# Altium project Custom Phone.PrjPcb (part 4 of 4)

## Sheet Sensors.SchDoc
size B; SheetNumber: 8; SheetTotal: 8
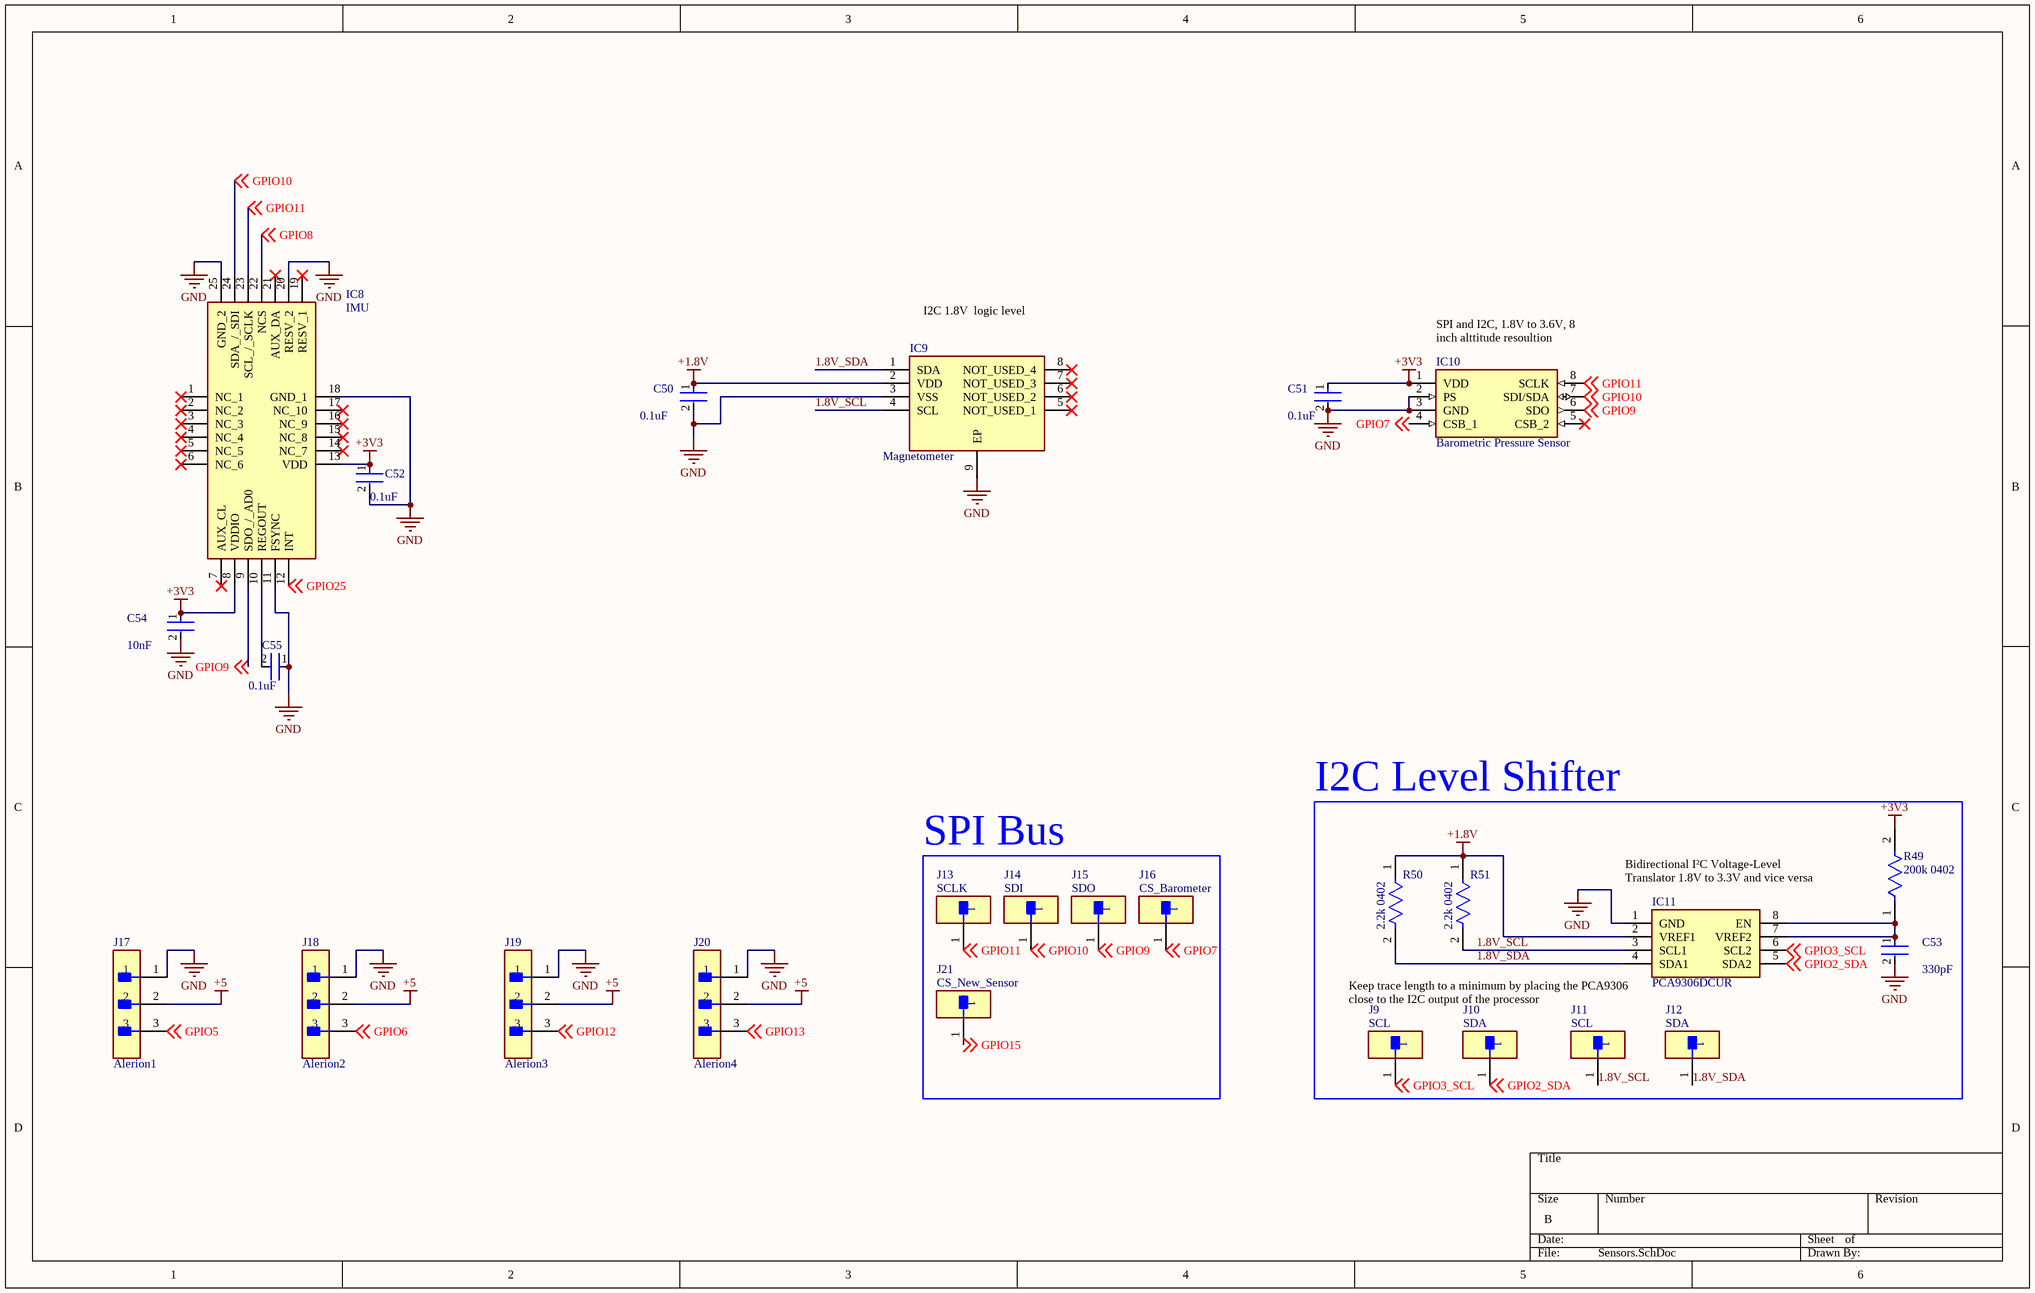
[diagram p11: Sensors.SchDoc]

### Parts
C50  0.1uF  [FP-C0402-BB-MFG]
C51  0.1uF  [FP-C0402-BB-MFG]
C52  0.1uF  [FP-C0402-BB-MFG]
C53  330pF  [FP-C0402-BB-MFG]
C54  10nF  [FP-C0402-BB-MFG]
C55  0.1uF  [FP-C0402-BB-MFG]
IC8  IMU  [QFN40P300X300X95-25N-D]
IC9  Magnetometer  [SON40P250X200X40-9N-D]
IC10  Barometric Pressure Sensor  [MS5607-02BA03]
IC11  PCA9306DCUR  [SOP50P310X90-8N]
J9  SCL  [FP-5015-MFG]
J10  SDA  [FP-5015-MFG]
J11  SCL  [FP-5015-MFG]
J12  SDA  [FP-5015-MFG]
J13  SCLK  [FP-5015-MFG]
J14  SDI  [FP-5015-MFG]
J15  SDO  [FP-5015-MFG]
J16  CS_Barometer  [FP-5015-MFG]
J17  Alerion1  [FP-TSW-103-14-G-S-MFG]
J18  Alerion2  [FP-TSW-103-14-G-S-MFG]
J19  Alerion3  [FP-TSW-103-14-G-S-MFG]
J20  Alerion4  [FP-TSW-103-14-G-S-MFG]
J21  CS_New_Sensor  [FP-5015-MFG]
R49  200k 0402  [FP-RMCF0402-MFG]
R50  2.2k 0402  [FP-RMCF0402-MFG]
R51  2.2k 0402  [FP-RMCF0402-MFG]

### Blocks framed on the sheet
I2C Level Shifter: C53 IC11 J9-J12 R49-R51
SPI Bus: J13-J16 J21

### Nets
+1.8V: C50.1 IC9.2(VDD) IC11.2(VREF1) R50.1 R51.1
+3V3: C51.1 C52.1 C54.1 IC8.8(VDDIO) IC8.13(VDD) IC10.1(VDD) R49.2
+5: J17.2 J18.2 J19.2 J20.2
GND: C50.2 C51.2 C52.2 C53.2 C54.2 C55.1 IC8.11(FSYNC) IC8.18(GND_1) IC8.20(RESV_2) IC8.25(GND_2) IC9.3(VSS) IC9.9(EP) IC10.2(PS) IC10.3(GND) IC11.1(GND) J17.1 J18.1 J19.1 J20.1
1.8V_SCL: IC9.4(SCL) IC11.3(SCL1) J11.1 R51.2
1.8V_SDA: IC9.1(SDA) IC11.4(SDA1) J12.1 R50.2
GPIO2_SDA: IC11.5(SDA2) J10.1 ; off-sheet GPIO2_SDA
GPIO3_SCL: IC11.6(SCL2) J9.1 ; off-sheet GPIO3_SCL
GPIO5: J17.3 ; off-sheet GPIO5
GPIO6: J18.3 ; off-sheet GPIO6
GPIO7: IC10.4(CSB_1) J16.1 ; off-sheet GPIO7
GPIO8: IC8.22(NCS) ; off-sheet GPIO8
GPIO9: IC8.9(SDO_/_AD0) IC10.6(SDO) J15.1 ; off-sheet GPIO9
GPIO10: IC8.24(SDA_/_SDI) IC10.7(SDI/SDA) J14.1 ; off-sheet GPIO10
GPIO11: IC8.23(SCL_/_SCLK) IC10.8(SCLK) J13.1 ; off-sheet GPIO11
GPIO12: J19.3 ; off-sheet GPIO12
GPIO13: J20.3 ; off-sheet GPIO13
GPIO15: J21.1 ; off-sheet GPIO15
GPIO25: IC8.12(INT) ; off-sheet GPIO25
NetC53_1: C53.1 IC11.7(VREF2) IC11.8(EN) R49.1
NetC55_2: C55.2 IC8.10(REGOUT)

Not connected (* = marked no-connect by the designer): IC8 1(NC_1)* 2(NC_2)* 3(NC_3)* 4(NC_4)* 5(NC_5)* 6(NC_6)* 7(AUX_CL)* 14(NC_7)* 15(NC_8)* 16(NC_9)* 17(NC_10)* 19(RESV_1)* 21(AUX_DA)*; IC9 5(NOT_USED_1)* 6(NOT_USED_2)* 7(NOT_USED_3)* 8(NOT_USED_4)*; IC10 5(CSB_2)*

### Notes on the sheet
- (near IC9) I2C 1.8V  logic level
- (near IC10) SPI and I2C, 1.8V to 3.6V, 8 inch alttitude resoultion
- (near IC11) Bidirectional I²C Voltage-Level Translator 1.8V to 3.3V and vice versa
- (near IC11) Keep trace length to a minimum by placing the PCA9306 close to the I2C output of the processor

### Library data of the parts
C50-C52 C55 = CMP-03020-014070-2: C307331; Manufacturer: Kemet; Manufacturer Part Number: C0402C104M3PAC7867; Material: Ceramic; Tolerance: 0.2; Temperature Characteristic: X5R; Value: 0.10 μF; Temperature Coefficient: 15%; Voltage Rating: 25 V; Height: 0.55mm; Category: Cap; Temperature: -55°C to +125°C; Automotive: No; Package: C0402-BB; Temperature Range Low: -55°C; ComponentLink2Description: Datasheet; Device Class L3: Ceramic Capacitors; ComponentLink2URL: https://content.kemet.com/datasheets/KEM_C1002_X7R_SMD.pdf; Octopart: https://octopart.com/c0402c104m3pac7867-kemet-84304880; RoHS: TRUE; Temperature Range High: +125°C; Device Class L1: Passive Components; Capacitance: 0.10 μF; Lead Free: Yes; Ipc Land Pattern Name: CAPC10050X50; Device Class L2: Capacitors; Digikey Description: CAP CER 0.1UF 25V X5R 0402
C53 = CMP-03020-014070-2: C13533; Manufacturer: Kemet; Manufacturer Part Number: C0402C104M3PAC7867; Material: Ceramic; Tolerance: 0.2; Temperature Characteristic: X5R; Value: 0.10 μF; Temperature Coefficient: 15%; Voltage Rating: 25 V; Height: 0.55mm; Category: Cap; Temperature: -55°C to +125°C; Automotive: No; Package: C0402-BB; Temperature Range Low: -55°C; ComponentLink2Description: Datasheet; Device Class L3: Ceramic Capacitors; ComponentLink2URL: https://content.kemet.com/datasheets/KEM_C1002_X7R_SMD.pdf; Octopart: https://octopart.com/c0402c104m3pac7867-kemet-84304880; RoHS: TRUE; Temperature Range High: +125°C; Device Class L1: Passive Components; Capacitance: 0.10 μF; Lead Free: Yes; Ipc Land Pattern Name: CAPC10050X50; Device Class L2: Capacitors; Digikey Description: CAP CER 0.1UF 25V X5R 0402
C54 = CMP-03020-014070-2: C15195; Manufacturer: Kemet; Manufacturer Part Number: C0402C104M3PAC7867; Material: Ceramic; Tolerance: 0.2; Temperature Characteristic: X5R; Value: 0.10 μF; Temperature Coefficient: 15%; Voltage Rating: 25 V; Height: 0.55mm; Category: Cap; Temperature: -55°C to +125°C; Automotive: No; Package: C0402-BB; Temperature Range Low: -55°C; ComponentLink2Description: Datasheet; Device Class L3: Ceramic Capacitors; ComponentLink2URL: https://content.kemet.com/datasheets/KEM_C1002_X7R_SMD.pdf; Octopart: https://octopart.com/c0402c104m3pac7867-kemet-84304880; RoHS: TRUE; Temperature Range High: +125°C; Device Class L1: Passive Components; Capacitance: 0.10 μF; Lead Free: Yes; Ipc Land Pattern Name: CAPC10050X50; Device Class L2: Capacitors; Digikey Description: CAP CER 0.1UF 25V X5R 0402
IC8 = MPU-6500: C50278; Manufacturer_Name: TDK; Datasheet Link: https://product.tdk.com/system/files/dam/doc/product/sensor/mortion-inertial/imu/data_sheet/mpu-6500-datasheet2.pdf; Height: 0.95mm; Manufacturer_Part_Number: MPU-6500; Mouser Part Number: 410-MPU-6500; Mouser Price/Stock: https://www.mouser.co.uk/ProductDetail/TDK-InvenSense/MPU-6500?qs=u4fy%2FsgLU9PiIOIlWOSPhQ%3D%3D; Arrow Part Number: MPU-6500; Arrow Price/Stock: https://www.arrow.com/en/products/mpu-6500/invensense?utm_currency=USD&region=europe
IC9 = MLX90392ELQ-AAA-011-RE: C17495733 / Digikey Replacment Part Just in Case: MLX90392ELQ-AAA-010-RE (10X finer resolution); Manufacturer_Name: Melexis; Datasheet Link: https://media.melexis.com/-/media/files/documents/datasheets/mlx90392-datasheet-melexis.pdf; Height: 0.4mm; Manufacturer_Part_Number: MLX90392ELQ-AAA-011-RE; Mouser Part Number: 482-90392ELQAAA011RE; Mouser Price/Stock: https://www.mouser.co.uk/ProductDetail/Melexis/MLX90392ELQ-AAA-011-RE?qs=DRkmTr78QAR2mFb3EZGuDA%3D%3D; LCSC: C17495733
IC10 = MS560702BA03-50: C97627; Manufacturer_Name: TE Connectivity; Datasheet Link: https://www.te.com/commerce/DocumentDelivery/DDEController?Action=srchrtrv&DocNm=MS5607-02BA03&DocType=Data%20Sheet&DocLang=English&PartCntxt=MS560702BA03-50&DocFormat=pdf; Manufacturer_Part_Number: MS560702BA03-50; Mouser Part Number: 824-MS560702BA03-50; Mouser Price/Stock: https://www.mouser.co.uk/ProductDetail/Measurement-Specialties/MS560702BA03-50?qs=urSpXqmdEVImCZG1H%252BT8ng%3D%3D; Arrow Part Number: MS560702BA03-50; Arrow Price/Stock: https://www.arrow.com/en/products/ms560702ba03-50/te-connectivity?utm_currency=USD&region=europe
IC11 = PCA9306DCUR: C33196; Manufacturer_Name: Texas Instruments; Datasheet Link: http://www.ti.com/lit/gpn/pca9306; Height: 0.9mm; Manufacturer_Part_Number: PCA9306DCUR; Mouser Part Number: 595-PCA9306DCUR; Mouser Price/Stock: https://www.mouser.co.uk/ProductDetail/Texas-Instruments/PCA9306DCUR?qs=wgAEGBTxy7nQr5PRxNBUNA%3D%3D; Arrow Part Number: PCA9306DCUR; Arrow Price/Stock: https://www.arrow.com/en/products/pca9306dcur/texas-instruments?region=nac
J9-J16 J21 = CMP-2000-05183-2: as J38-J44 on sheet Cellular; Category: Conn; Digikey Description: PC TEST POINT MINIATURE; Automotive: No; Lead Free: Yes; Octopart: https://octopart.com/5015-keystone-3822; ComponentLink2URL: http://www.keyelco.com/product-pdf.cfm?p=1353; Package: 5015; RoHS: TRUE; Device Class L3: unset; Device Class L2: unset; Contact Material: Silver; Device Class L1: Connectors; Height: 1.65mm; ComponentLink2Description: Datasheet
J17-J20 = CMP-02766-001743-1: CONN HEADER VERT 3POS 2.54MM; Max Voltage Rating (AC): 550V; Number of Positions: 3; Max Current Rating: 7.6A; Gender: Male; Termination: Solder; RoHS Compliant: Yes; Mount: Through Hole; Lead Free: Lead Free; Connector Type: Header; REACH SVHC: No SVHC; Insulation Color: Black; Width: 2.54mm; Length: 7.62mm; Flammability Rating: UL94 V-0; Housing Material: Polyester; Contact Material: Bronze; Max Operating Temperature: 125°C; Fastening Type: Pull; Series: TSW; Number of Contacts: 3; Packaging: Bulk; Min Operating Temperature: -55°C; Package Quantity: 1; Height: 10.67mm; Pitch: 2.54mm; Contact Finish - Mating: GOLD; Contact Type: Male Pin; Radiation Hardening: No; Color: Black; Housing Color: Black; Contact Plating: Gold; Orientation: Straight; Number of Rows: 1; Depth: 2.54mm; Insulation Material: PBT; Contact Mating Length: 0.32inch; Contact Shape: Square
R49 = CMP-26527-002093-1: C25764; Max Power Dissipation: 63mW; Tolerance: 5%; Resistance: 3.9R; Temperature Coefficient: 200ppm/°C; Case/Package: 0402; Number of Terminations: 2; Min Operating Temperature: -55°C; Height: 0.016inch; Packaging: Tape and Reel; Resistor Type: Thick Film; Length: 0.039inch; Mount: Surface Mount; Series: RMCF; Max Operating Temperature: 155°C; Contact Plating: Tin; Features: Automotive AEC-Q200; Width: 0.02inch; Radiation Hardening: No; RoHS Compliant: Yes
R50 R51 = CMP-26527-002093-1: C25879; Max Power Dissipation: 63mW; Tolerance: 5%; Resistance: 3.9R; Temperature Coefficient: 200ppm/°C; Case/Package: 0402; Number of Terminations: 2; Min Operating Temperature: -55°C; Height: 0.016inch; Packaging: Tape and Reel; Resistor Type: Thick Film; Length: 0.039inch; Mount: Surface Mount; Series: RMCF; Max Operating Temperature: 155°C; Contact Plating: Tin; Features: Automotive AEC-Q200; Width: 0.02inch; Radiation Hardening: No; RoHS Compliant: Yes

## Sheet Camera + Display.SchDoc
size A; SheetNumber: 9; SheetTotal: 9
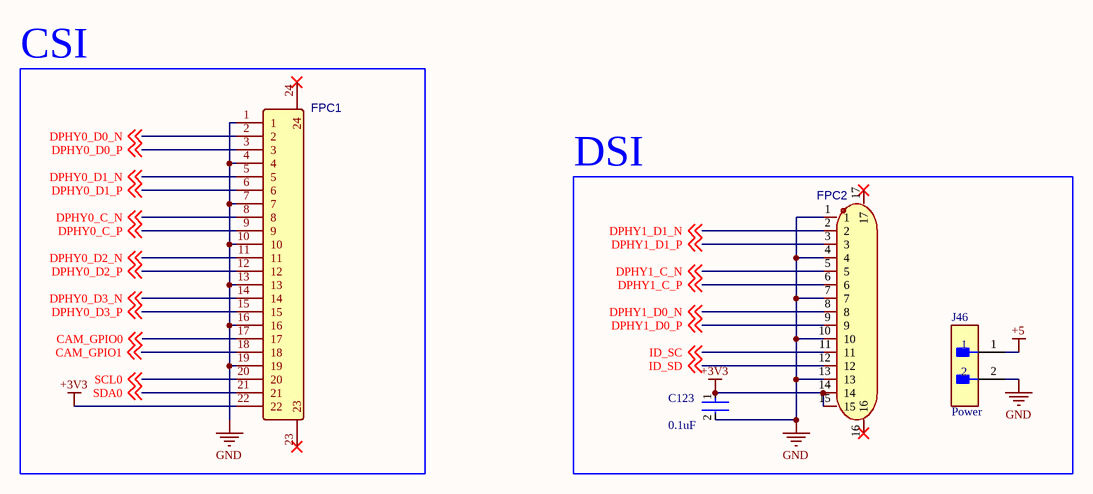
[diagram p12: Camera + Display.SchDoc]

### Parts
C123  0.1uF  [FP-C0402-BB-MFG]
FPC1  AFC01-S22FCA-00  [FPC-SMD_P0.5-22P_FGS-XJ-H2.0]  (value not drawn)
FPC2  HC-FPC-1.0-15P-FHH20  [FPC-SMD_15P-P0.50_HC-FPC-1.0-15P-FHH20]  (value not drawn)
J46  Power  [FP-TSW-102-14-G-S-MFG]

### Blocks framed on the sheet
CSI: FPC1
DSI: C123 FPC2 J46

### Nets
+3V3: C123.1 FPC1.22 FPC2.14 FPC2.15
+5: J46.1
GND: C123.2 FPC1.1 FPC1.4 FPC1.7 FPC1.10 FPC1.13 FPC1.16 FPC1.19 FPC2.1 FPC2.4 FPC2.7 FPC2.10 FPC2.13 J46.2
CAM_GPIO0: FPC1.17 ; off-sheet CAM_GPIO0
CAM_GPIO1: FPC1.18 ; off-sheet CAM_GPIO1
DPHY0_C_N: FPC1.8 ; off-sheet DPHY0_C_N
DPHY0_C_P: FPC1.9 ; off-sheet DPHY0_C_P
DPHY0_D0_N: FPC1.2 ; off-sheet DPHY0_D0_N
DPHY0_D0_P: FPC1.3 ; off-sheet DPHY0_D0_P
DPHY0_D1_N: FPC1.5 ; off-sheet DPHY0_D1_N
DPHY0_D1_P: FPC1.6 ; off-sheet DPHY0_D1_P
DPHY0_D2_N: FPC1.11 ; off-sheet DPHY0_D2_N
DPHY0_D2_P: FPC1.12 ; off-sheet DPHY0_D2_P
DPHY0_D3_N: FPC1.14 ; off-sheet DPHY0_D3_N
DPHY0_D3_P: FPC1.15 ; off-sheet DPHY0_D3_P
DPHY1_C_N: FPC2.5 ; off-sheet DPHY1_C_N
DPHY1_C_P: FPC2.6 ; off-sheet DPHY1_C_P
DPHY1_D0_N: FPC2.8 ; off-sheet DPHY1_D0_N
DPHY1_D0_P: FPC2.9 ; off-sheet DPHY1_D0_P
DPHY1_D1_N: FPC2.2 ; off-sheet DPHY1_D1_N
DPHY1_D1_P: FPC2.3 ; off-sheet DPHY1_D1_P
ID_SC: FPC2.11 ; off-sheet ID_SC
ID_SD: FPC2.12 ; off-sheet ID_SD
SCL0: FPC1.20 ; off-sheet SCL0
SDA0: FPC1.21 ; off-sheet SDA0

Not connected (* = marked no-connect by the designer): FPC1 23* 24*; FPC2 16* 17*

### Library data of the parts
C123 = CMP-03020-014070-2: as C50 on sheet Sensors; Height: 0.55mm; Category: Cap; Temperature: -55°C to +125°C; Automotive: No; Package: C0402-BB; Temperature Range Low: -55°C; ComponentLink2Description: Datasheet; Device Class L3: Ceramic Capacitors; ComponentLink2URL: https://content.kemet.com/datasheets/KEM_C1002_X7R_SMD.pdf; Octopart: https://octopart.com/c0402c104m3pac7867-kemet-84304880; RoHS: TRUE; Temperature Range High: +125°C; Device Class L1: Passive Components; Capacitance: 0.10 μF; Lead Free: Yes; Ipc Land Pattern Name: CAPC10050X50; Device Class L2: Capacitors; Digikey Description: CAP CER 0.1UF 25V X5R 0402
FPC1 = CSI Bottom Contact Right Angle: C262668; Manufacturer: JS(钜硕电子); Contributor: LCSC; Supplier: LCSC; Supplier Part: C262668; Manufacturer Part: AFC01-S22FCA-00; JLCPCB Part Class: Extended Part; spicePre: F; spiceSymbolName: AFC01-S22FCA-00
FPC2 = DSI Top and Bottom Connector: C49166884; Manufacturer: HC(虹成电子); Add into BOM: yes; Locking Feature: Hinged Lid; Number of Contacts: 15P; Pitch: 1mm; FFC, FCB Thickness: 0.3mm; Symbol: HC-FPC-1.0-15P-FHH20; Device: HC-FPC-1.0-15P-FHH20; LCSC Part Name: 翻盖式 双侧触点/上下接 P数:15P 间距:1mm; Supplier Part: C49166884; Manufacturer Part: HC-FPC-1.0-15P-FHH20; Supplier Footprint: SMD,P=1mm,卧贴; JLCPCB Part Class: Extended Part; Datasheet: https://item.szlcsc.com/datasheet/HC-FPC-1.0-15P-FHH20/51557854.html; Supplier: LCSC; Convert to PCB: yes; Contact Type: Double-Sided Contacts, Top and Bottom Entry; Mounting Type: Surface Mount, Right Angle; Height Above Board: 2mm; Contact Material: -; Contact Plating: -; Operating Temperature: -40℃~+85℃
J46 = CMP-02766-001740-1: CONN HEADER VERT 2POS 2.54MM; Number of Positions: 2; Max Current Rating: 7.6A; Gender: Male; Max Voltage Rating (AC): 550V; Contact Mating Length: 0.32inch; REACH SVHC: No SVHC; Width: 2.54mm; Insulation Material: PBT; Contact Shape: Square; Contact Plating: Gold; Min Operating Temperature: -55°C; Contact Material: Bronze; Color: Black; Number of Contacts: 2; Housing Material: Polyester; Orientation: Straight; Flammability Rating: UL94 V-0; Max Operating Temperature: 125°C; Contact Type: Male Pin; Radiation Hardening: No; Termination: Solder; RoHS Compliant: Yes; Lead Free: Lead Free; Fastening Type: Pull; Pitch: 2.54mm; Number of Rows: 1; Series: TSW; Insulation Color: Black; Package Quantity: 1; Connector Type: Header; Length: 5.08mm; Contact Finish - Mating: GOLD; Mount: Through Hole; Housing Color: Black; Depth: 2.54mm; Packaging: Bulk

## Nets that join several sheets
3V3_M2: High-Speed Interfaces (14 pins), Power (C42.2 C43.2 L3.2 R45.1)
5V_Direct_PD_Out: Power (6 pins), USBC (5 pins)
+1.8V: CM5 + IO (J1.88 J1.90), Cellular (C118.1 U4.2 U4.10), Sensors (5 pins)
+3.9V: CM5 + IO (J5.1 LED1.2), Power (C32.2 C33.2 L2.2 R38.1), Cellular (10 pins)
+3V3: CM5 + IO (21 pins), High-Speed Interfaces (J25.15 J25.17), USBC (24 pins), Cellular (5 pins), Audio (12 pins), Sensors (7 pins), Camera + Display (C123.1 FPC1.22 FPC2.14 FPC2.15)
+5: CM5 + IO (8 pins), High-Speed Interfaces (J24.19), Power (16 pins), USBC (5 pins), Audio (R101.2 R103.1), Sensors (J17.2 J18.2 J19.2 J20.2), Camera + Display (J46.1)
Bat+: Power (D5.2), Battery Management and Charging (9 pins)
GND: CM5 + IO (79 pins), High-Speed Interfaces (29 pins), Power (57 pins), Battery Management and Charging (15 pins), USBC (87 pins), Cellular (46 pins), Audio (23 pins), Sensors (19 pins), Camera + Display (14 pins)
VCC_USB_Bat: CM5 + IO (LED3.1), USBC (16 pins)
VCC_USB_Bat_Sink: Power (C10.2 IC4.2 IC4.3 Q6.2), Battery Management and Charging (C68.2 IC13.1), USBC (C89.2 Q15.3)
VCC_USB_Power: CM5 + IO (LED4.1), USBC (18 pins)
CAM_GPIO0: CM5 + IO (J1.97), Camera + Display (FPC1.17)
CAM_GPIO1: CM5 + IO (J1.100), Camera + Display (FPC1.18)
DPHY0_C_N: CM5 + IO (J2.27), Camera + Display (FPC1.8)
DPHY0_C_P: CM5 + IO (J2.29), Camera + Display (FPC1.9)
DPHY0_D0_N: CM5 + IO (J2.15), Camera + Display (FPC1.2)
DPHY0_D0_P: CM5 + IO (J2.17), Camera + Display (FPC1.3)
DPHY0_D1_N: CM5 + IO (J2.21), Camera + Display (FPC1.5)
DPHY0_D1_P: CM5 + IO (J2.23), Camera + Display (FPC1.6)
DPHY0_D2_N: CM5 + IO (J2.33), Camera + Display (FPC1.11)
DPHY0_D2_P: CM5 + IO (J2.35), Camera + Display (FPC1.12)
DPHY0_D3_N: CM5 + IO (J2.39), Camera + Display (FPC1.14)
DPHY0_D3_P: CM5 + IO (J2.41), Camera + Display (FPC1.15)
DPHY1_C_N: CM5 + IO (J2.87), Camera + Display (FPC2.5)
DPHY1_C_P: CM5 + IO (J2.89), Camera + Display (FPC2.6)
DPHY1_D0_N: CM5 + IO (J2.75), Camera + Display (FPC2.8)
DPHY1_D0_P: CM5 + IO (J2.77), Camera + Display (FPC2.9)
DPHY1_D1_N: CM5 + IO (J2.81), Camera + Display (FPC2.2)
DPHY1_D1_P: CM5 + IO (J2.83), Camera + Display (FPC2.3)
E_LED_G: CM5 + IO (J1.17), High-Speed Interfaces (R53.1)
E_LED_Y: CM5 + IO (J1.15), High-Speed Interfaces (R54.2)
GPIO2_SDA: CM5 + IO (CAM1.1 J1.58), USBC (IC16.8 U2.8), Audio (U5.18), Sensors (IC11.5 J10.1)
GPIO3_SCL: CM5 + IO (CAM1.4 J1.56), USBC (IC16.7 U2.9), Audio (U5.19), Sensors (IC11.6 J9.1)
GPIO4: CM5 + IO (J1.54), Audio (U5.20)
GPIO5: CM5 + IO (J1.34 R3.1), Sensors (J17.3)
GPIO6: CM5 + IO (J1.30 R4.1), Sensors (J18.3)
GPIO7: CM5 + IO (J1.37), Sensors (IC10.4 J16.1)
GPIO8: CM5 + IO (J1.39), Sensors (IC8.22)
GPIO9: CM5 + IO (J1.40), Sensors (IC8.9 IC10.6 J15.1)
GPIO10: CM5 + IO (J1.44), Sensors (IC8.24 IC10.7 J14.1)
GPIO11: CM5 + IO (J1.38), Sensors (IC8.23 IC10.8 J13.1)
GPIO12: CM5 + IO (J1.31 R7.1), Sensors (J19.3)
GPIO13: CM5 + IO (J1.28 R8.1), Sensors (J20.3)
GPIO15: CM5 + IO (J1.51 J7.1 W1.1 W2.1), Sensors (J21.1)
GPIO16: CM5 + IO (J1.29), Audio (R105.1 R106.2)
GPIO17: CM5 + IO (J1.50), Cellular (J37.6)
GPIO18: CM5 + IO (J1.49), Audio (IC17.16 U5.6)
GPIO19: CM5 + IO (J1.26), Audio (IC17.14 U5.7)
GPIO20: CM5 + IO (J1.27), Audio (U5.3)
GPIO21: CM5 + IO (J1.25), Audio (IC17.1)
GPIO22: CM5 + IO (J1.46), Cellular (J37.8)
GPIO23: CM5 + IO (J1.47), Cellular (J37.23 R95.1)
GPIO24: CM5 + IO (J1.45), Cellular (R97.1)
GPIO25: CM5 + IO (J1.41), Sensors (IC8.12)
HDMI0_CEC: CM5 + IO (J2.51), High-Speed Interfaces (J24.15)
HDMI0_CK_N: CM5 + IO (J2.90), High-Speed Interfaces (J24.14)
HDMI0_CK_P: CM5 + IO (J2.88), High-Speed Interfaces (J24.12)
HDMI0_D0_N: CM5 + IO (J2.84), High-Speed Interfaces (J24.11)
HDMI0_D0_P: CM5 + IO (J2.82), High-Speed Interfaces (J24.9)
HDMI0_D1_N: CM5 + IO (J2.78), High-Speed Interfaces (J24.8)
HDMI0_D1_P: CM5 + IO (J2.76), High-Speed Interfaces (J24.6)
HDMI0_D2_N: CM5 + IO (J2.72), High-Speed Interfaces (J24.5)
HDMI0_D2_P: CM5 + IO (J2.70), High-Speed Interfaces (J24.3)
HDMI0_HOTPLUG: CM5 + IO (J2.53), High-Speed Interfaces (J24.1)
HDMI0_SCL: CM5 + IO (J2.100), High-Speed Interfaces (J24.17)
HDMI0_SDA: CM5 + IO (J2.99), High-Speed Interfaces (J24.18)
ID_SC: CM5 + IO (J1.35), Camera + Display (FPC2.11)
ID_SD: CM5 + IO (J1.36), Camera + Display (FPC2.12)
PCIE_CLK_N: CM5 + IO (J2.12), High-Speed Interfaces (J23.53)
PCIE_CLK_P: CM5 + IO (J2.10), High-Speed Interfaces (J23.55)
PCIE_nCLKREQ: CM5 + IO (J2.2), High-Speed Interfaces (J23.52)
PCIE_nRST: CM5 + IO (J2.9), High-Speed Interfaces (J23.50)
PCIE_nWAKE: CM5 + IO (J2.4), High-Speed Interfaces (J23.54)
PCIE_PWR_EN: CM5 + IO (J2.6), Power (IC7.3)
PCIE_RX_N: CM5 + IO (J2.18), High-Speed Interfaces (J23.43)
PCIE_RX_P: CM5 + IO (J2.16), High-Speed Interfaces (J23.41)
PCIE_TX_N: CM5 + IO (J2.24), High-Speed Interfaces (J23.49)
PCIE_TX_P: CM5 + IO (J2.22), High-Speed Interfaces (J23.47)
SCL0: CM5 + IO (J1.80), Camera + Display (FPC1.20)
SDA0: CM5 + IO (J1.82), Camera + Display (FPC1.21)
TRD0_N: CM5 + IO (J1.10), High-Speed Interfaces (D8.5 J25.2)
TRD0_P: CM5 + IO (J1.12), High-Speed Interfaces (D8.4 J25.1)
TRD1_N: CM5 + IO (J1.6), High-Speed Interfaces (D8.1 J25.6)
TRD1_P: CM5 + IO (J1.4), High-Speed Interfaces (D8.2 J25.3)
TRD2_N: CM5 + IO (J1.9), High-Speed Interfaces (D9.4 J25.8)
TRD2_P: CM5 + IO (J1.11), High-Speed Interfaces (D9.5 J25.7)
TRD3_N: CM5 + IO (J1.5), High-Speed Interfaces (D9.2 J25.10)
TRD3_P: CM5 + IO (J1.3), High-Speed Interfaces (D9.1 J25.9)
USB2_Bat_D_N: CM5 + IO (J2.36), USBC (D14.1 J29.A7 J29.B7)
USB2_Bat_D_P: CM5 + IO (J2.34), USBC (D15.1 J29.A6 J29.B6)
USB2_D_N: CM5 + IO (J2.3), Cellular (D18.1 J37.9)
USB2_D_P: CM5 + IO (J2.5), Cellular (D17.1 J37.7)
USB2_Power_D_N: CM5 + IO (J2.65), USBC (D12.1 J28.A7 J28.B7)
USB2_Power_D_P: CM5 + IO (J2.63), USBC (D13.1 J28.A6 J28.B6)
USB3-0-RX_N: CM5 + IO (J2.28), USBC (IC14.16)
USB3-0-RX_P: CM5 + IO (J2.30), USBC (IC14.15)
USB3-0-TX_N: CM5 + IO (J2.40), USBC (IC14.12)
USB3-0-TX_P: CM5 + IO (J2.42), USBC (IC14.11)
USB3-1-RX_N: CM5 + IO (J2.57), USBC (IC15.16)
USB3-1-RX_P: CM5 + IO (J2.59), USBC (IC15.15)
USB3-1-TX_N: CM5 + IO (J2.69), USBC (IC15.12)
USB3-1-TX_P: CM5 + IO (J2.71), USBC (IC15.11)